# Altium schematic sheet CW340_USERIO_Breakout.SchDoc: Breakout from Edge Connector
size Letter; Organization: NewAE Technology Inc.; Address1: 1083 Queen St., Suite 196; Address2: Halifax; Address3: NS; Address4: Canada B3H 0B2; SheetApproved: NO
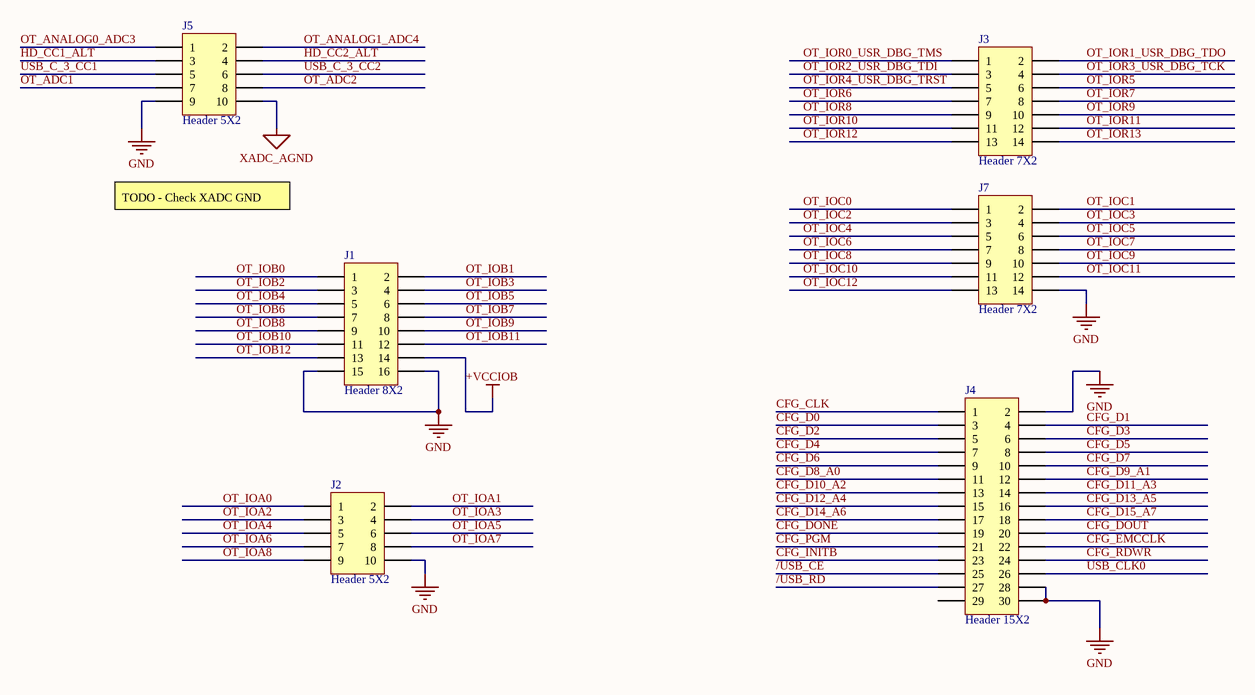
[diagram p0: CW340_USERIO_Breakout.SchDoc]

## Parts
J1  Header 8X2  [HDR2X8]
J2  Header 5X2  [HDR2X5]
J3  Header 7X2  [HDR2X7]
J4  Header 15X2  [HDR2X15]
J5  Header 5X2  [HDR2X5]
J7  Header 7X2  [HDR2X7]

## Nets
+VCCIOB: J1.14
GND: J1.15 J1.16 J2.10 J4.2 J4.28 J4.30 J5.9 J7.14
XADC_AGND: J5.10
/USB_CE: J4.25
/USB_RD: J4.27
CFG_CLK: J4.1
CFG_D0: J4.3
CFG_D1: J4.4
CFG_D2: J4.5
CFG_D3: J4.6
CFG_D4: J4.7
CFG_D5: J4.8
CFG_D6: J4.9
CFG_D7: J4.10
CFG_D8_A0: J4.11
CFG_D9_A1: J4.12
CFG_D10_A2: J4.13
CFG_D11_A3: J4.14
CFG_D12_A4: J4.15
CFG_D13_A5: J4.16
CFG_D14_A6: J4.17
CFG_D15_A7: J4.18
CFG_DONE: J4.19
CFG_DOUT: J4.20
CFG_EMCCLK: J4.22
CFG_INITB: J4.23
CFG_PGM: J4.21
CFG_RDWR: J4.24
HD_CC1_ALT: J5.3
HD_CC2_ALT: J5.4
OT_ADC1: J5.7
OT_ADC2: J5.8
OT_ANALOG0_ADC3: J5.1
OT_ANALOG1_ADC4: J5.2
OT_IOA0: J2.1
OT_IOA1: J2.2
OT_IOA2: J2.3
OT_IOA3: J2.4
OT_IOA4: J2.5
OT_IOA5: J2.6
OT_IOA6: J2.7
OT_IOA7: J2.8
OT_IOA8: J2.9
OT_IOB0: J1.1
OT_IOB1: J1.2
OT_IOB2: J1.3
OT_IOB3: J1.4
OT_IOB4: J1.5
OT_IOB5: J1.6
OT_IOB6: J1.7
OT_IOB7: J1.8
OT_IOB8: J1.9
OT_IOB9: J1.10
OT_IOB10: J1.11
OT_IOB11: J1.12
OT_IOB12: J1.13
OT_IOC0: J7.1
OT_IOC1: J7.2
OT_IOC2: J7.3
OT_IOC3: J7.4
OT_IOC4: J7.5
OT_IOC5: J7.6
OT_IOC6: J7.7
OT_IOC7: J7.8
OT_IOC8: J7.9
OT_IOC9: J7.10
OT_IOC10: J7.11
OT_IOC11: J7.12
OT_IOC12: J7.13
OT_IOR0_USR_DBG_TMS: J3.1
OT_IOR1_USR_DBG_TDO: J3.2
OT_IOR2_USR_DBG_TDI: J3.3
OT_IOR3_USR_DBG_TCK: J3.4
OT_IOR4_USR_DBG_TRST: J3.5
OT_IOR5: J3.6
OT_IOR6: J3.7
OT_IOR7: J3.8
OT_IOR8: J3.9
OT_IOR9: J3.10
OT_IOR10: J3.11
OT_IOR11: J3.12
OT_IOR12: J3.13
OT_IOR13: J3.14
USB_C_3_CC1: J5.5
USB_C_3_CC2: J5.6
USB_CLK0: J4.26

Not connected (* = marked no-connect by the designer): J4 29

## Notes on the sheet
- TODO - Check XADC GND
- Title:
- Date:
- Rev:
- Time:
- Project:
- Sheet
- of
- License:
- Copyright © NewAE Technology Inc.
- Approved:
- NewAE.com
- File:

## Library data of the parts
J1 = Header 8X2: Header, 8-Pin, Dual row; LatestRevisionDate: 17-Jul-2002; LatestRevisionNote: Re-released for DXP Platform.; Publisher: Altium Limited
J2 J5 = Header 5X2: Header, 5-Pin, Dual row; LatestRevisionDate: 17-Jul-2002; LatestRevisionNote: Re-released for DXP Platform.; Publisher: Altium Limited
J3 J7 = Header 7X2: Header, 7-Pin, Dual row; LatestRevisionDate: 17-Jul-2002; LatestRevisionNote: Re-released for DXP Platform.; Publisher: Altium Limited
J4 = Header 15X2: Header, 15-Pin, Dual row; LatestRevisionDate: 17-Jul-2002; LatestRevisionNote: Re-released for DXP Platform.; Publisher: Altium Limited